# EasyEDA Pro project ProPrj_RMwork_2025-11-14.epro

# Schematic Schematic1
Board Name: Board1; Create Date: 2025-11-13; Page Name: P1; Project Name: RMwork; Schematic Name: Schematic1; Update Date: 2025-11-14; Company: 嘉立创EDA; Page Size: A4; Version: V1.0
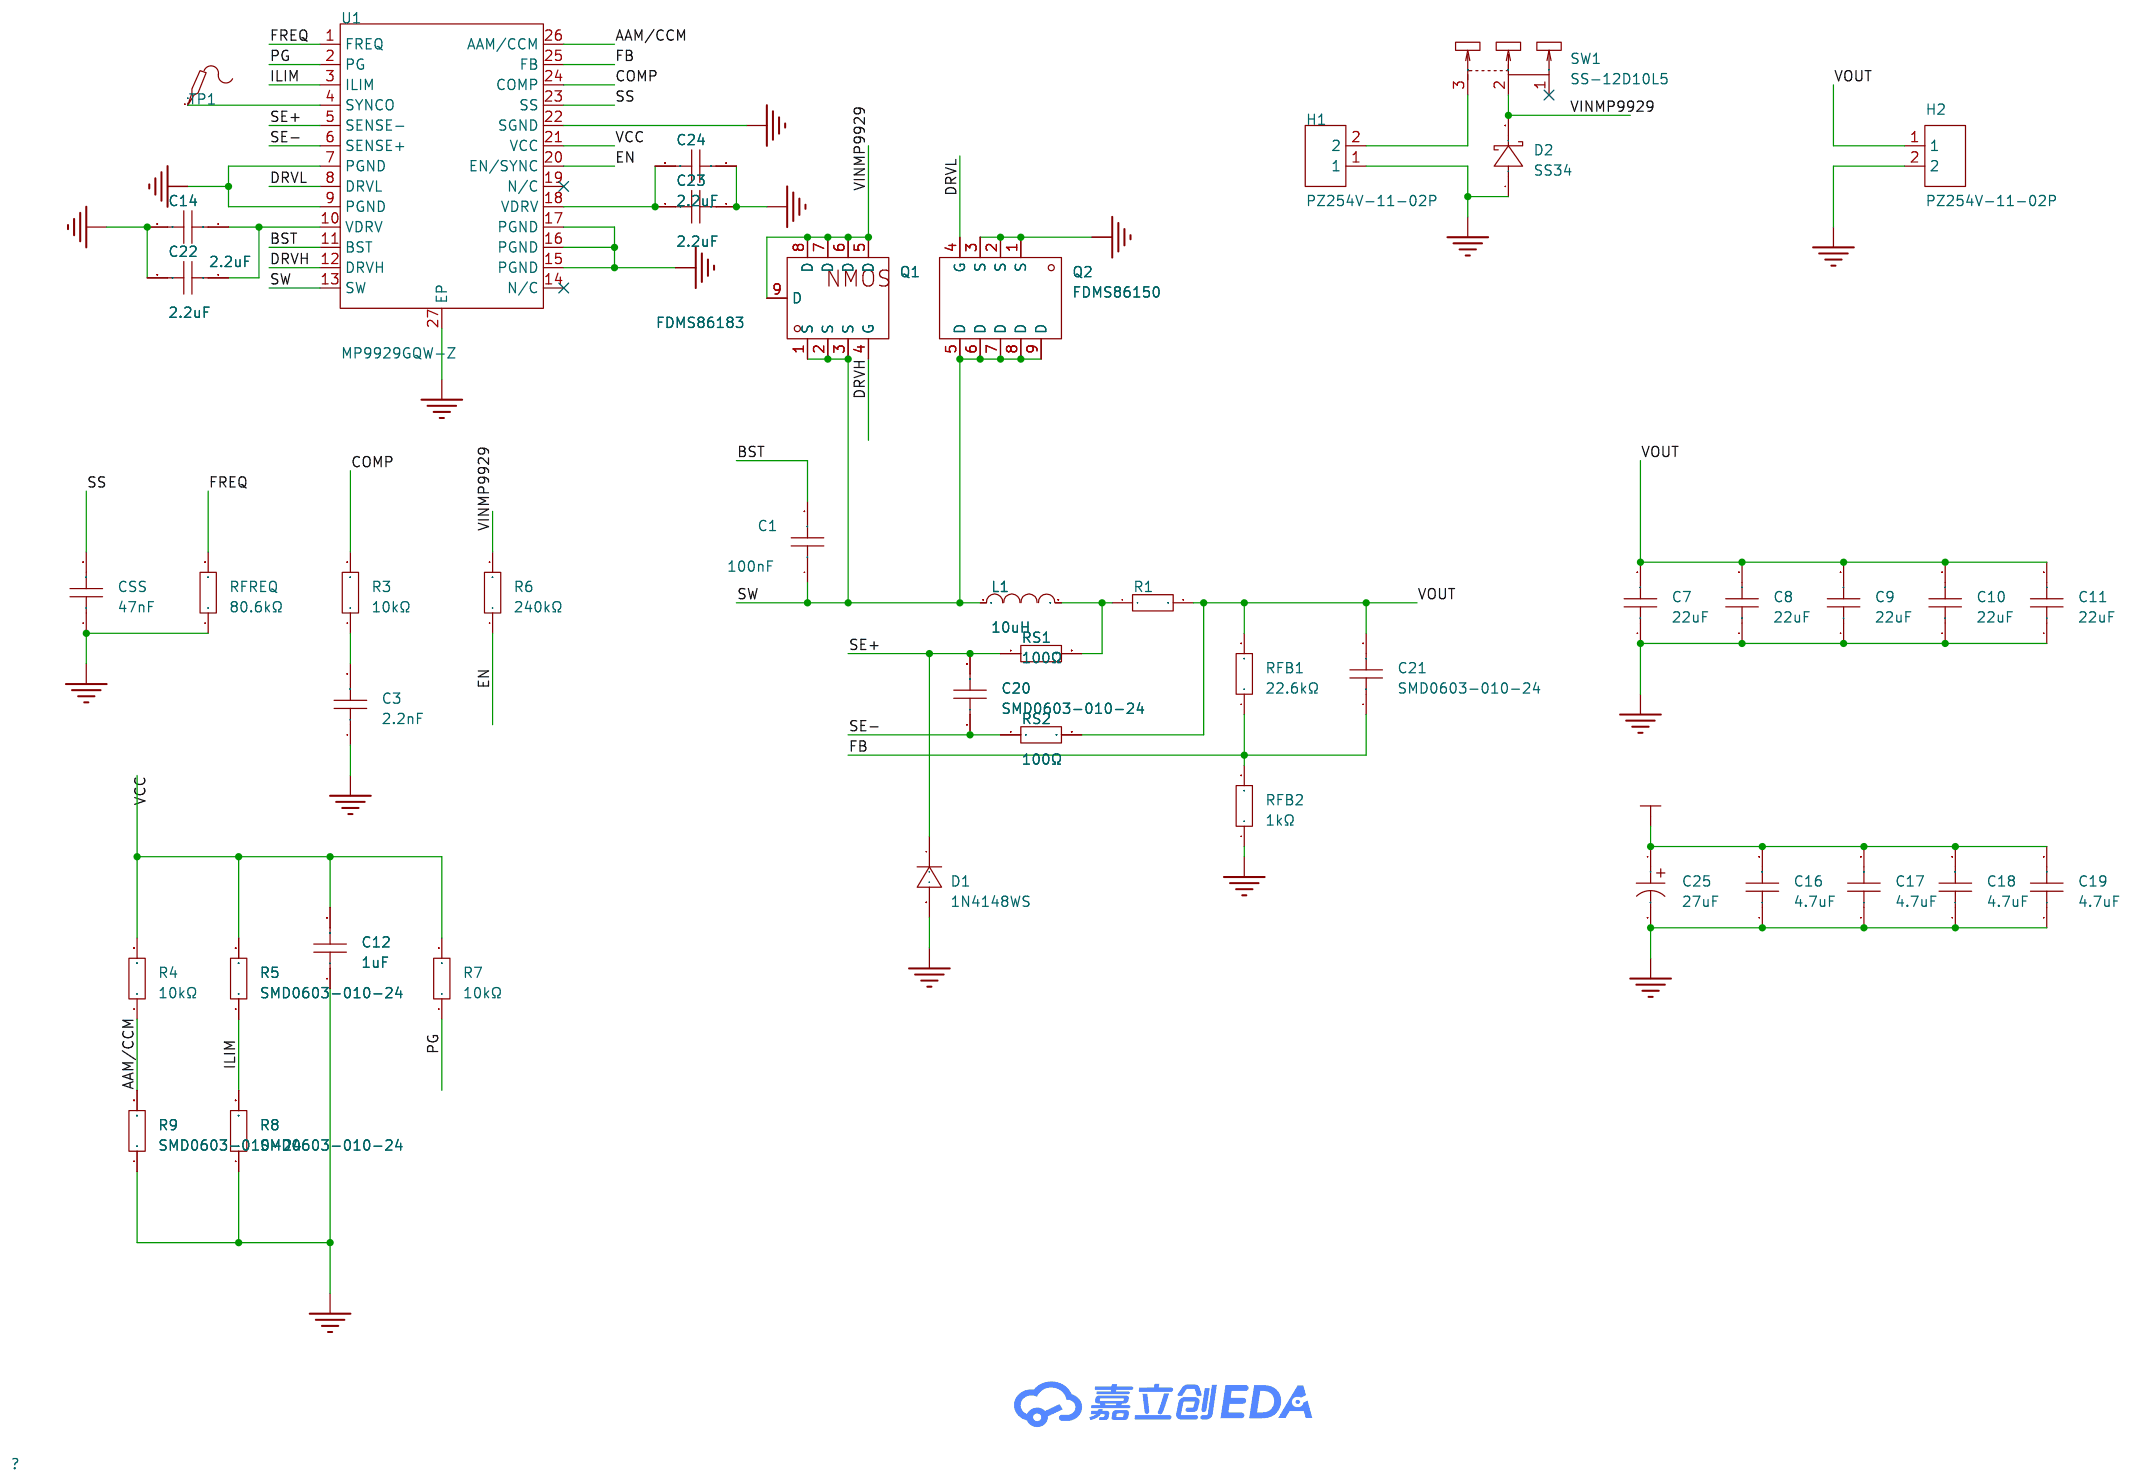
[diagram p0: schematic sheet]

## Parts
C1  100nF  [C0603]
C3  2.2nF  [C0603]
C7  22uF  [C0603]
C8  22uF  [C0603]
C9  22uF  [C0603]
C10  22uF  [C0603]
C11  22uF  [C0603]
C12  1uF  [C0603]
C14  2.2uF  [C0603]
C16  4.7uF  [C0603]
C17  4.7uF  [C0603]
C18  4.7uF  [C0603]
C19  4.7uF  [C0603]
C20  SMD0603-010-24  [F0603]
C21  SMD0603-010-24  [F0603]
C22  2.2uF  [C0603]
C23  2.2uF  [C0603]
C24  2.2uF  [C0603]
C25  27uF  [CAP-SMD_BD5.0-L5.3-W5.3-LS6.0-FD]
CSS  47nF  [C0603]
D1  1N4148WS  [SOD-323_L1.8-W1.3-LS2.5-RD]
D2  SS34  [SMA_L4.3-W2.6-LS5.0-FD]
H1  PZ254V-11-02P  [HDR-TH_2P-P2.54-V-M]
H2  PZ254V-11-02P  [HDR-TH_2P-P2.54-V-M]
L1  10uH  [IND-SMD_L11.5-W10.0_FXL1040]
Q1  FDMS86183  [POWER-56_L5.0-W6.0-P1.27-LS6.2-BL]
Q2  FDMS86150  [POWER-56_L5.0-W6.0-P1.27-LS6.2-BL]
R1  6mΩ  [RES-SMD_L6.4-W3.2-R2512]
R3  10kΩ  [R0603]
R4  10kΩ  [R0603]
R5  SMD0603-010-24  [F0603]
R6  240kΩ  [R0603]
R7  10kΩ  [R0603]
R8  SMD0603-010-24  [F0603]
R9  SMD0603-010-24  [F0603]
RFB1  22.6kΩ  [R0603]
RFB2  1kΩ  [R0603]
RFREQ  80.6kΩ  [R0603]
RS1  100Ω  [R0603]
RS2  100Ω  [R0603]
SW1  SS-12D10L5  [SW-TH_SS-12D10L5]
TP1  -  [Test-Point-0.5mm]
U1  MP9929GQW-Z  [QFN-26_L6.0-W4.0-P0.50_MP9929GQW-Z]

## Library data of the parts
C1 = CC0603KRX7R9BB104: 容值:100nF;精度:±10%;额定电压:50V;温度系数:X7R;; LCSC Part Name: 100nF ±10% 50V; Supplier Part: C14663; Manufacturer: YAGEO(国巨); Supplier Footprint: 0603; JLCPCB Part Class: Basic Part; Datasheet: https://item.szlcsc.com/datasheet/CC0603KRX7R9BB104/15331.html; Supplier: LCSC; Tolerance: ±10%; Voltage Rating: 50V; Temperature Coefficient: X7R
C3 = FCC0603B222K500CT: 容值:2.2nF;精度:±10%;额定电压:50V;温度系数:X7R;; LCSC Part Name: 2.2nF ±10% 50V; Supplier Part: C5137562; Manufacturer: FOJAN(富捷); Supplier Footprint: 0603; JLCPCB Part Class: Extended Part; Datasheet: https://atta.szlcsc.com/upload/public/pdf/source/20220818/0EB3B7FB2F5648AC16609637FBA7DABE.pdf; Supplier: LCSC; Tolerance: ±10%; Voltage Rating: 50V; Temperature Coefficient: X7R
C7-C11 = CGA0603X5R226M160JT: 容值:22uF;精度:±20%;额定电压:16V;温度系数:X5R;; LCSC Part Name: 22uF ±20% 16V; Supplier Part: C6119868; Manufacturer: HRE(芯声); Supplier Footprint: 0603; JLCPCB Part Class: Extended Part; Datasheet: https://item.szlcsc.com/datasheet/CGA0603X5R226M160JT/7062574.html; Supplier: LCSC; Tolerance: ±20%; Voltage Rating: 16V; Temperature Coefficient: X5R
C12 = CGA0603X5R105K160JT: 容值:1uF;精度:±10%;额定电压:16V;温度系数:X5R;; LCSC Part Name: 1uF ±10% 16V; Supplier Part: C6119849; Manufacturer: HRE(芯声); Supplier Footprint: 0603; JLCPCB Part Class: Extended Part; Supplier: LCSC; Tolerance: ±10%; Voltage Rating: 16V; Temperature Coefficient: X5R
C14 C22-C24 = CL10A225KA8NNNC: 容值:2.2uF;精度:±10%;额定电压:25V;温度系数:X5R;; LCSC Part Name: 2.2uF ±10% 25V; Supplier Part: C57895; Manufacturer: SAMSUNG(三星); Supplier Footprint: 0603; JLCPCB Part Class: Extended Part; Datasheet: https://item.szlcsc.com/datasheet/CL10A225KA8NNNC/58932.html; Supplier: LCSC; Tolerance: ±10%; Voltage Rating: 25V; Temperature Coefficient: X5R
C16-C19 = CL10A475KO8NNNC: 容值:4.7uF;精度:±10%;额定电压:16V;温度系数:X5R;; LCSC Part Name: 4.7uF ±10% 16V; Supplier Part: C19666; Manufacturer: SAMSUNG(三星); Supplier Footprint: 0603; JLCPCB Part Class: Basic Part; Datasheet: https://item.szlcsc.com/datasheet/CL10A475KO8NNNC/20375.html; Supplier: LCSC; Tolerance: ±10%; Voltage Rating: 16V; Temperature Coefficient: X5R
C20 C21 R5 R8 R9 = SMD0603-010-24: 耐压(Vmax):24V;最大电流(Imax):40A;保持电流(Ihold):100mA;跳闸电流(Itrip):300mA;; Supplier Part: C46640956; Manufacturer: R+O(宏嘉诚); Supplier Footprint: 0603; JLCPCB Part Class: Extended Part; Datasheet: https://item.szlcsc.com/datasheet/SMD0603-010-24/48798662.html; Supplier: LCSC; Voltage - Max: 24V; Current - Max: 40A; Hold Current: 100mA; Trip Current: 300mA; Power Dissipation: 500mW; Resistance - Initial (Ri) (Min): 900mΩ; Resistance - Post Trip (R1) (Max): 8Ω; Time to Trip(Max): 600ms; Operating Temperature: -40℃~+85℃; Length: 1.6mm; Width: 0.8mm
C25 = 25SVPF27MX: 容值:27uF;精度:±20%;额定电压:25V;纹波电流:2.45A@100kHz;等效串联电阻(ESR):-;类型:聚合物;; LCSC Part Name: 27uF ±20% 25V; Supplier Part: C347564; Manufacturer: PANASONIC(松下); Supplier Footprint: SMD,D5xL5.9mm; JLCPCB Part Class: Extended Part; Datasheet: https://item.szlcsc.com/datasheet/25SVPF27MX/324244.html; Supplier: LCSC; Tolerance: ±20%; Voltage Rating: 25V; Ripple Current: 2.45A@100kHz; Type: 聚合物; Diameter: 5mm; Height - Seated (Max): 5.9mm; Lifetime: 5000hrs@105℃; Operating Temperature: -55℃~+105℃
CSS = CL10B473KB8NNNC: 容值:47nF;精度:±10%;额定电压:50V;温度系数:X7R;; LCSC Part Name: 47nF ±10% 50V; Supplier Part: C1622; Manufacturer: SAMSUNG(三星); Supplier Footprint: 0603; JLCPCB Part Class: Basic Part; Datasheet: https://item.szlcsc.com/datasheet/CL10B473KB8NNNC/1974.html; Supplier: LCSC; Tolerance: ±10%; Voltage Rating: 50V; Temperature Coefficient: X7R
D1 = 1N4148WS_C2128: 二极管配置:独立式;正向压降(Vf):1.25V@150mA;直流反向耐压(Vr):100V;整流电流:150mA;反向恢复时间(Trr):4ns;; LCSC Part Name: 丝印T4 1N4148WS; Supplier Part: C2128; Manufacturer: CJ(江苏长电/长晶); Supplier Footprint: SOD-323; JLCPCB Part Class: 基础库; Datasheet: https://item.szlcsc.com/datasheet/1N4148WS/2485.html; Supplier: LCSC; Diode Configuration: 独立式; Voltage - Forward(Vf@If): 1.25V@150mA; Voltage - DC Reverse(Vr): 100V; Current - Rectified: 150mA; Pd - Power Dissipation: 200mW; Reverse Leakage Current (Ir): 1uA@75V; Reverse Recovery Time (trr): 4ns; Non-Repetitive Peak Forward Surge Current: 2A
D2 = SS34_C7420365: 二极管配置:独立式;正向压降(Vf):550mV@3.0A;直流反向耐压(Vr):40V;整流电流:3A;; LCSC Part Name: 电压:40V 电流:3A; Supplier Part: C7420365; Manufacturer: R+O(宏嘉诚); Supplier Footprint: SMA(DO-214AC); JLCPCB Part Class: 扩展库; Datasheet: https://item.szlcsc.com/datasheet/SS34/8397187.html; Supplier: LCSC; Diode Configuration: 独立式; Voltage - Forward(Vf@If): 550mV@3.0A; Voltage - DC Reverse(Vr): 40V; Current - Rectified: 3A; Reverse Leakage Current (Ir): 200uA@40V
H1 H2 = PZ254V-11-02P: 插针结构:1x2P;间距:2.54mm;行距:-;圆针/方针:方针;安装方式:直插;排数:单排;总PIN位数:2P;额定电流:-;额定电压:-;配合针长度:6mm;塑高:2.5mm;端接针长度:3mm;触头材质:黄铜;触头镀层:-;工作温度:-40℃~+105℃;颜色:黑色;; LCSC Part Name: 1x2P 间距:2.54mm 方针 直插; Supplier Part: C492401; Manufacturer: XFCN(兴飞); Supplier Footprint: 插件,P=2.54mm; JLCPCB Part Class: 扩展库; Datasheet: https://item.szlcsc.com/datasheet/PZ254V-11-02P/502957.html; Supplier: LCSC; Pin Structure: 1x2P; Pitch: 2.54mm; Circluar Pins/Square Pins: 方针; Mounting Type: 直插; Number of Rows: 单排; Number of Pins: 2P; Length of Mating Pin: 6mm; Insulation Height: 2.5mm; Length of End Connection Pin: 3mm; Contact Material: 黄铜; Operating Temperature: -40℃~+105℃; Color: 黑色
L1 = FXL1040-100-M: 电感值:10uH;精度:±20%;额定电流:7.8A;饱和电流(Isat):8.5A;类型:一体成型电感;; LCSC Part Name: 10uH ±20% 8.5A; Supplier Part: C475915; Manufacturer: cjiang(长江微电); Supplier Footprint: SMD,11.5x10mm; JLCPCB Part Class: Extended Part; Datasheet: https://atta.szlcsc.com/upload/public/pdf/source/20240426/3189EA8206330E2108542F9E34E540E7.pdf; Supplier: LCSC; Tolerance: ±20%; Rated Current: 7.8A; Current - Saturation (Isat): 8.5A; DC Resistance (DCR): 30mΩ; Type: 一体成型电感
Q1 = FDMS86183: 类型:-;漏源电压(Vdss):-;连续漏极电流(Id):-;功率(Pd):-;导通电阻(RDS(on)@Vgs,Id):-;阈值电压(Vgs(th)@Id):-;; LCSC Part Name: N 沟道屏蔽门极 PowerTrench MOSFET 100 V，51 A，12.8 mΩ; Supplier Part: C891093; Manufacturer: onsemi(安森美); Supplier Footprint: Power-56-8; JLCPCB Part Class: 扩展库; Datasheet: https://atta.szlcsc.com/upload/public/pdf/source/20210624/C891093_BCD16E45048C0D0D4E3284DC0FFDD818.pdf; Supplier: LCSC
Q2 = FDMS86150: 数量:1个N沟道;漏源电压(Vdss):100V;连续漏极电流(Id):80A;导通电阻(RDS(on)):7.8mΩ@6V,13A;耗散功率(Pd):156W;阈值电压(Vgs(th)):2V;; LCSC Part Name: 1个N沟道 耐压:100V 电流:80A; Supplier Part: C455161; Manufacturer: onsemi(安森美); Supplier Footprint: Power56-8; JLCPCB Part Class: 扩展库; Datasheet: https://item.szlcsc.com/datasheet/FDMS86150/457746.html; Supplier: LCSC; Number: 1个N沟道; Drain to Source Voltage: 100V; Current - Continuous Drain(Id): 80A; RDS(on): 7.8mΩ@6V,13A; Pd - Power Dissipation: 156W; Gate Threshold Voltage (Vgs(th)): 2V; Input Capacitance(Ciss): 3.055nF@50V; Reverse Transfer Capacitance (Crss@Vds): 29pF@50V; Operating Temperature: -55℃~+150℃
R1 = RE2512F3R006: 电阻类型:采样电阻；合金电阻;阻值:6mΩ;精度:±1%;功率:3W;温度系数:±100ppm/℃;; LCSC Part Name: 6mΩ 3W 2512 ±1%; Supplier Part: C46961751; Manufacturer: JIERR(捷而瑞); Supplier Footprint: 2512; JLCPCB Part Class: Extended Part; Datasheet: https://item.szlcsc.com/datasheet/RE2512F3R006/49133290.html; Supplier: LCSC; Type: 采样电阻；合金电阻; Tolerance: ±1%; Power(Watts): 3W; Temperature Coefficient: ±100ppm/℃
R3 R4 R7 = 0603WAF1002T5E: 电阻类型:厚膜电阻;阻值:10kΩ;精度:±1%;功率:100mW;工作电压:75V;温度系数:±100ppm/℃;; LCSC Part Name: 厚膜电阻 10kΩ ±1% 100mW; Supplier Part: C25804; Manufacturer: UNI-ROYAL(厚声); Supplier Footprint: 0603; JLCPCB Part Class: Basic Part; Datasheet: https://item.szlcsc.com/datasheet/0603WAF1002T5E/26547.html; Supplier: LCSC; Type: 厚膜电阻; Tolerance: ±1%; Power(Watts): 100mW; Voltage-Supply(Max): 75V; Temperature Coefficient: ±100ppm/℃; Operating Temperature: -55℃~+155℃
R6 = 0603WAF2403T5E: 电阻类型:厚膜电阻;阻值:240kΩ;精度:±1%;功率:100mW;最大工作电压:75V;温度系数:±100ppm/℃;; LCSC Part Name: 240kΩ ±1% 100mW 厚膜电阻; Supplier Part: C4197; Manufacturer: UNI-ROYAL(厚声); Supplier Footprint: 0603; JLCPCB Part Class: Extended Part; Datasheet: https://atta.szlcsc.com/upload/public/pdf/source/20200306/C422600_1E6D84923E4A46A82E41ADD87F860B5C.pdf; Supplier: LCSC; Type: 厚膜电阻; Tolerance: ±1%; Power(Watts): 100mW; Overload Voltage (Max): 75V; Temperature Coefficient: ±100ppm/℃; Operating Temperature Range: -55℃~+155℃
RFB1 = PTFR0603B22K6N9: 电阻类型:薄膜电阻;阻值:22.6kΩ;精度:±0.1%;功率:100mW;工作电压:100V;温度系数:±10ppm/℃;; LCSC Part Name: 薄膜电阻 22.6kΩ ±0.1% 100mW; Supplier Part: C5382615; Manufacturer: RESI(开步睿思); Supplier Footprint: 0603; JLCPCB Part Class: Extended Part; Datasheet: https://item.szlcsc.com/datasheet/PTFR0603B22K6N9/6255150.html; Supplier: LCSC; Type: 薄膜电阻; Tolerance: ±0.1%; Power(Watts): 100mW; Voltage-Supply(Max): 100V; Temperature Coefficient: ±10ppm/℃; Operating Temperature: -55℃~+155℃
RFB2 = FRC0603F1001TS: 电阻类型:厚膜电阻;阻值:1kΩ;精度:±1%;功率:100mW;工作电压:75V;温度系数:±100ppm/℃;; LCSC Part Name: 1kΩ ±1% 100mW 厚膜电阻; Supplier Part: C2907002; Manufacturer: FOJAN(富捷); Supplier Footprint: 0603; JLCPCB Part Class: Extended Part; Supplier: LCSC; Type: 厚膜电阻; Tolerance: ±1%; Power(Watts): 100mW; Voltage-Supply(Max): 75V; Temperature Coefficient: ±100ppm/℃; Operating Temperature: -55℃~+155℃
RFREQ = FRC0603F8062TS: 电阻类型:厚膜电阻;阻值:80.6kΩ;精度:±1%;功率:100mW;工作电压:75V;温度系数:±100ppm/℃;; LCSC Part Name: 80.6kΩ ±1% 100mW 厚膜电阻; Supplier Part: C2933260; Manufacturer: FOJAN(富捷); Supplier Footprint: 0603; JLCPCB Part Class: Extended Part; Supplier: LCSC; Type: 厚膜电阻; Tolerance: ±1%; Power(Watts): 100mW; Voltage-Supply(Max): 75V; Temperature Coefficient: ±100ppm/℃; Operating Temperature: -55℃~+155℃
RS1 RS2 = 0603WAF1000T5E: 电阻类型:厚膜电阻;阻值:100Ω;精度:±1%;功率:100mW;最大工作电压:75V;温度系数:±200ppm/℃;; LCSC Part Name: 100Ω ±1% 100mW 厚膜电阻; Supplier Part: C22775; Manufacturer: UNI-ROYAL(厚声); Supplier Footprint: 0603; JLCPCB Part Class: Basic Part; Datasheet: https://atta.szlcsc.com/upload/public/pdf/source/20200306/C422600_1E6D84923E4A46A82E41ADD87F860B5C.pdf; Supplier: LCSC; Type: 厚膜电阻; Tolerance: ±1%; Power(Watts): 100mW; Overload Voltage (Max): 75V; Temperature Coefficient: ±200ppm/℃; Operating Temperature Range: -55℃~+155℃
SW1 = SS-12D10L5: 电路结构:单刀双掷;安装方式:直插;开关颜色:黑色;额定电流:3A;额定电压:125V;工作寿命:1万次;; LCSC Part Name: 柄长5mm 直插双档 滑动开关; Supplier Part: C319012; Manufacturer: XKB Connection(中国星坤); Supplier Footprint: 插件,13x6.8mm; JLCPCB Part Class: 扩展库; Datasheet: https://item.szlcsc.com/datasheet/SS-12D10L5/300104.html; Supplier: LCSC; Circuit: 单刀双掷; Actuator Style: 矩形柱状; Termination Style: PC引脚; Length: 13mm; Width: 6.8mm; Switch Height: 6.4mm; Mounting Type: 直插; Actuator Color: 黑色; Current Rating: 3A; Voltage Rating: 125V; Life: 1万次; Operating Temperature: -40℃~+85℃
TP1 = Test-Point: Test Point 测试点
U1 = MP9929GQW-Z: Supplier Part: C16197344; Manufacturer: MPS(芯源); Supplier Footprint: QFN-26-EP(4x6); JLCPCB Part Class: 扩展库; Supplier: LCSC

## Nets
GND: C3.1 C7.1 C8.1 C9.1 C10.1 C11.1 C12.1 C14.2 C16.1 C17.1 C18.1 C19.1 C22.2 C23.1 C24.1 C25.2 CSS.1 D1.2(A) D2.1(A) H1.1 H2.2 Q2.1(S) Q2.2(S) Q2.3(S) R8.1 R9.1 RFB2.1 RFREQ.1 U1.7(PGND) U1.9(PGND) U1.15(PGND) U1.16(PGND) U1.17(PGND) U1.22(SGND) U1.27(EP)
VCC: C12.2 R4.2 R5.2 R7.2 U1.21(VCC)
VINMP9929: C16.2 C17.2 C18.2 C19.2 C25.1 D2.2(K) Q1.5(D) Q1.6(D) Q1.7(D) Q1.8(D) Q1.9(D) R6.2 SW1.2
AAM/CCM: R4.1 R9.2 U1.26(AAM/CCM)
BST: C1.2 U1.11(BST)
COMP: R3.2 U1.24(COMP)
DRVH: Q1.4(G) U1.12(DRVH)
DRVL: Q2.4(G) U1.8(DRVL)
EN: R6.1 U1.20(EN/SYNC)
FB: C21.1 RFB1.1 RFB2.2 U1.25(FB)
FREQ: RFREQ.2 U1.1(FREQ)
ILIM: R5.1 R8.2 U1.3(ILIM)
PG: R7.1 U1.2(PG)
SE+: C20.2 D1.1(K) RS1.1 U1.5(SENSE-)
SE-: C20.1 RS2.1 U1.6(SENSE+)
SS: CSS.2 U1.23(SS)
SW: C1.1 L1.1 Q1.1(S) Q1.2(S) Q1.3(S) Q2.5(D) Q2.6(D) Q2.7(D) Q2.8(D) Q2.9(D) U1.13(SW)
VOUT: C7.2 C8.2 C9.2 C10.2 C11.2 C21.2 H2.1 R1.2 RFB1.2 RS2.2
$1N1291: L1.2 R1.1 RS1.2
$1N2376: C3.2 R3.1
$1N3160: TP1.1 U1.4(SYNCO)
$1N3351: C23.2 C24.2 U1.18(VDRV)
$1N3457: C14.1 C22.1 U1.10(VDRV)
$1N5328: H1.2 SW1.3

Not connected (* = marked no-connect by the designer): SW1 1*; U1 14(N/C)* 19(N/C)*

# Board PCB1
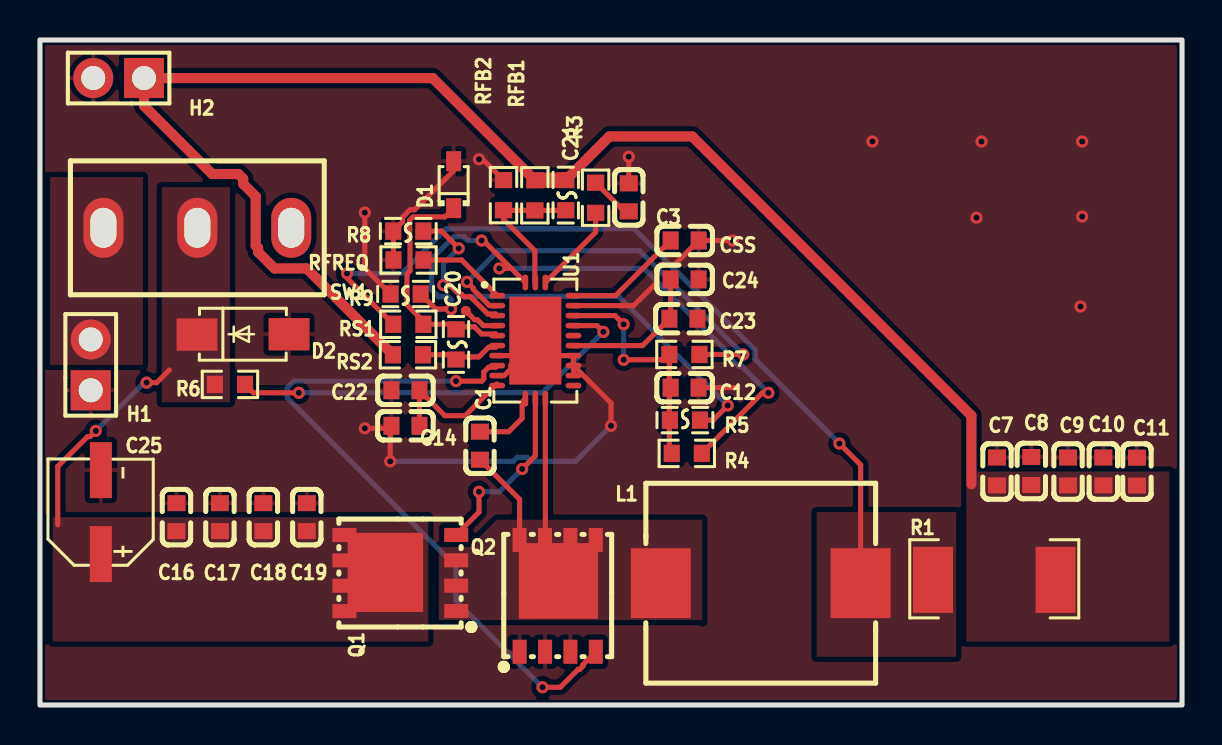
[diagram p1: board, top side]
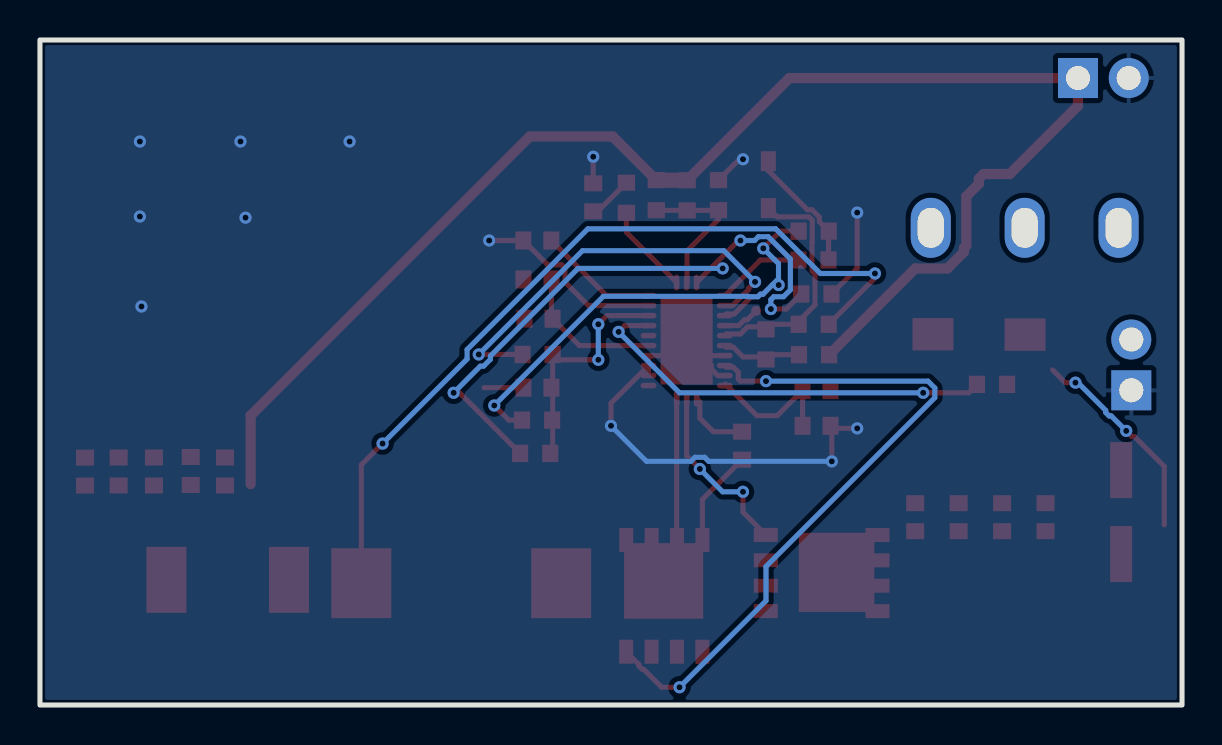
[diagram p2: board, bottom side, seen from below]

Outline 57.15 x 33.27 mm; copper layers: Top Layer, Bottom Layer. Coordinates in mm from the lower left corner of the outline.
Outline path: rectangle 0,33.27 57.15,0
Stack: Top Layer 0.035mm / Dielectric1 1.51mm FR4 er 4.5 / Bottom Layer 0.035mm

## Design rules (mm)
template: 自定义配置
spacing copperThickness1oz (default): track to track 0.102, other pairs 0.152 to 0.508
spacing copperThickness2oz: track to track 0.203, other pairs 0.152 to 0.3
track width copperThickness1oz (default): min 0.127, default 0.254, max 2.54
track width copperThickness2oz: min 0.203, default 0.254, max 2.54
differential pair differentialPair (default): width min 0.127, default 0.254, max 2.54; gap min 0.152, default 0.152
via viaSize (default): diameter min 0.5, default 0.61, max 10; hole min 0.3, default 0.305, max 6.299

## Placement (name value [footprint] x y rotation side)
C1  100nF  [C0603]  22.02 12.97 90 top
C3  2.2nF  [C0603]  29.46 25.4 270 top
C7  22uF  [C0603]  47.89 11.68 270 top
C8  22uF  [C0603]  49.61 11.71 270 top
C9  22uF  [C0603]  51.45 11.68 270 top
C10  22uF  [C0603]  53.21 11.68 270 top
C11  22uF  [C0603]  54.89 11.68 270 top
C12  1uF  [C0603]  32.26 15.88 180 top
C14  2.2uF  [C0603]  18.29 13.97 180 top
C16  4.7uF  [C0603]  6.83 9.4 270 top
C17  4.7uF  [C0603]  9.01 9.4 270 top
C18  4.7uF  [C0603]  11.18 9.4 270 top
C19  4.7uF  [C0603]  13.35 9.4 270 top
C20  SMD0603-010-24  [F0603]  20.82 18.04 90 top
C21  SMD0603-010-24  [F0603]  26.31 25.51 90 top
C22  2.2uF  [C0603]  18.29 15.75 180 top
C23  2.2uF  [C0603]  32.2 19.33 180 top
C24  2.2uF  [C0603]  32.26 21.3 180 top
C25  27uF  [CAP-SMD_BD5.0-L5.3-W5.3-LS6.0-FD]  3.05 9.65 90 top
CSS  47nF  [C0603]  32.26 23.24 180 top
D1  1N4148WS  [SOD-323_L1.8-W1.3-LS2.5-RD]  20.7 26.03 90 top
D2  SS34  [SMA_L4.3-W2.6-LS5.0-FD]  10.16 18.54 180 top
H1  PZ254V-11-02P  [HDR-TH_2P-P2.54-V-M]  2.54 17.02 90 top
H2  PZ254V-11-02P  [HDR-TH_2P-P2.54-V-M]  3.94 31.37 180 top
L1  10uH  [IND-SMD_L11.5-W10.0_FXL1040]  36.07 6.1 0 top
Q1  FDMS86183  [POWER-56_L5.0-W6.0-P1.27-LS6.2-BL]  18.03 6.6 90 top
Q2  FDMS86150  [POWER-56_L5.0-W6.0-P1.27-LS6.2-BL]  25.91 5.46 0 top
R1  6mΩ  [RES-SMD_L6.4-W3.2-R2512]  47.75 6.26 0 top
R3  10kΩ  [R0603]  27.8 25.38 270 top
R4  10kΩ  [R0603]  32.37 12.59 180 top
R5  SMD0603-010-24  [F0603]  32.27 14.25 180 top
R6  240kΩ  [R0603]  9.51 16.04 180 top
R7  10kΩ  [R0603]  32.25 17.54 180 top
R8  SMD0603-010-24  [F0603]  18.43 23.71 0 top
R9  SMD0603-010-24  [F0603]  18.3 20.57 0 top
RFB1  22.6kΩ  [R0603]  24.76 25.5 90 top
RFB2  1kΩ  [R0603]  23.2 25.51 270 top
RFREQ  80.6kΩ  [R0603]  18.44 22.26 0 top
RS1  100Ω  [R0603]  18.43 19.05 180 top
RS2  100Ω  [R0603]  18.42 17.53 180 top
SW1  SS-12D10L5  [SW-TH_SS-12D10L5]  7.87 23.88 180 top
TP1  -  [Test-Point-0.5mm]  21.31 19.72 0 top
U1  MP9929GQW-Z  [QFN-26_L6.0-W4.0-P0.50_MP9929GQW-Z]  24.79 18.23 270 top

## Footprints (pads in the part's own frame, mm; a bottom-side part is the same pattern mirrored in y, then rotated)
C0603
  rect 0.8x0.9 smd: 1(-0.7,0) 2(0.7,0)
CAP-SMD_BD5.0-L5.3-W5.3-LS6.0-FD
  rect 2.8x1.1 smd: 1(-2.1,0) 2(2.1,0)
F0603
  rect 0.806x0.864 smd: 1(-0.753,0) 2(0.753,0)
HDR-TH_2P-P2.54-V-M
  rect 2x2 hole 1.2: 1(-1.27,0)
  round 2 hole 1.2: 2(1.27,0)
IND-SMD_L11.5-W10.0_FXL1040
  rect 3x3.5 smd: 1(-5,0) 2(5,0)
POWER-56_L5.0-W6.0-P1.27-LS6.2-BL
  rect 0.7x1.2 smd: 1(-1.903,-2.796) 2(-0.633,-2.796) 3(0.636,-2.796) 4(1.907,-2.796) 5(1.903,2.796) 6(0.633,2.796) 7(-0.636,2.796) 8(-1.907,2.796)
  rect 3.96x3.78 smd: 9(0.032,0.748)
QFN-26_L6.0-W4.0-P0.50_MP9929GQW-Z
  oval 0.28x0.79 smd: 1(-2.25,-1.907) 2(-1.75,-1.907) 3(-1.25,-1.907) 4(-0.75,-1.907) 5(-0.25,-1.907) 6(0.25,-1.907) 7(0.75,-1.907) 8(1.25,-1.907) 9(1.75,-1.907) 10(2.25,-1.907) 14(2.25,1.907) 15(1.75,1.907) 16(1.25,1.907) 17(0.75,1.907) 18(0.25,1.907) 19(-0.25,1.907) 20(-0.75,1.907) 21(-1.25,1.907) 22(-1.75,1.907) 23(-2.25,1.907)
  oval 0.79x0.28 smd: 11(2.908,-0.5) 12(2.908,0) 13(2.908,0.5) 24(-2.908,0.5) 25(-2.908,0) 26(-2.908,-0.5)
  rect 4.4x2.6 smd: 27(0,0)
R0603
  rect 0.806x0.864 smd: 1(-0.753,0) 2(0.753,0)
RES-SMD_L6.4-W3.2-R2512
  rect 2x3.3 smd: 1(-3.067,0) 2(3.067,0)
SMA_L4.3-W2.6-LS5.0-FD
  rect 2.046x1.62 smd: 1(-2.304,-0.009) 2(2.304,0.009)
SOD-323_L1.8-W1.3-LS2.5-RD
  rect 1x0.75 smd: 1(-1.173,0) 2(1.173,0)
SW-TH_SS-12D10L5
  oval 2x3 hole 1.3x2: 1(-4.7,0) 2(0,0) 3(4.7,0)
Test-Point-0.5mm
  round 0.5 smd: 1(0,0)

## Nets
As in the schematic.

Pads without a net: SW1 1; U1 14 19

## Via types
v1: diameter 0.61, hole 0.305, Top Layer to Bottom Layer, 34 vias

## Routing (per net, layer and track width the routed paths; a pad name or vN(x,y) marks a point on that pad's centre or on a via; arc(x,y) is an arc through that point)
GND: length 50.4
  Top Layer w0.254: v1(17.53,12.19) 17.53,13.91 17.46,13.84 v1(16.26,13.84) ; U1.7 24.04,17.48 23.56,17 23.56,16.81 23.23,16.48 U1.9 ; RFREQ.1 17.69,23.7 R8.1 18.15,24.18 18.15,24.41 18.52,24.78 18.75,24.78 20.7,26.73 D1.2 ; v1(34.67,23.24) CSS.1 31.74,22.02 31.04,22.02 30.88,21.86 30.88,21.16 29.7,19.98 U1.22 ; v1(28.58,13.97) 28.58,15.11 U1.16 ; v1(21.97,27.3) 22.16,27.3 RFB2.1 ; C3.1 v1(29.46,27.43) ; v1(16.26,24.64) 16.26,21.85 R9.1 ; U1.16 U1.15 ; U1.16 U1.17 25.54,17.48 U1.27 ; C12.1 34.92,15.88
  Bottom Layer w0.254: v1(28.58,13.97) 26.8,12.19 24.58,12.19 24.37,12.39 23.89,12.39 23.69,12.19 v1(17.53,12.19)
  vias: v1(41.66,28.19) v1(46.86,24.38) v1(47.12,28.19) v1(52.07,19.94) v1(52.15,28.19) v1(52.15,24.44)
VCC: length 11.9
  Top Layer w0.254: 31.61,12.59 31.49,12.71 R7.2 31.23,17.27 v1(29.21,17.27) ; v1(29.21,19.05) 28.78,19.48 U1.21
  Bottom Layer w0.254: v1(29.21,19.05) v1(29.21,17.27)
VINMP9929: length 10.6
  Top Layer w0.254: 0.89,9.02 0.89,11.94 2.38,13.43 2.51,13.43 v1(2.79,13.72) ; 6.48,16.76 5.84,16.13 v1(5.33,16.13)
  Bottom Layer w0.254: v1(2.79,13.72) 3.55,14.47 3.66,14.47 3.82,14.63 3.82,14.74 5.21,16.13 v1(5.33,16.13)
AAM/CCM: length 32.4
  Top Layer w0.254: R9.2 19.8,19.81 v1(20.57,19.81) ; 23.59,21.84 22.19,23.24 v1(22.1,23.24) ; 23.59,21.84 U1.26 ; 23.59,21.84 v1(22.99,21.84) ; v1(36.45,15.62) 36.15,15.62 R4.1
  Bottom Layer w0.254: v1(36.45,15.62) 35.11,16.96 34.95,16.96 34.61,17.3 34.61,17.46 30.23,21.84 v1(22.99,21.84) ; v1(20.57,19.81) 20.57,20.28 20.43,20.43 19.94,20.43 19.6,20.77 19.6,22.32 20.71,23.43 21.2,23.43 21.39,23.24 v1(22.1,23.24)
BST: length 3.4
  Top Layer w0.254: U1.11 24.13,15.17 24.13,14.35 23.45,13.67 C1.2
COMP: length 4.5
  Top Layer w0.254: R3.2 27.8,23.66 U1.24
DRVH: length 9.1
  Top Layer w0.254: Q1.4 21.97,9.65 v1(21.97,10.67) ; v1(24.13,11.81) 24.79,12.47 U1.12
  Bottom Layer w0.254: v1(21.97,10.67) 22.99,10.67 v1(24.13,11.81)
DRVL: length 34.9
  Top Layer w0.254: v1(25.15,0.89) 26.04,0.89 26.94,1.79 27.01,1.79 27.17,1.95 27.17,2.02 Q2.4 ; U1.8 22.8,16.9 22.45,16.9 22.21,16.66 22.21,16.31 22.1,16.2 v1(20.82,16.2)
  Bottom Layer w0.254: v1(25.15,0.89) 20.82,5.22 20.82,6.93 12.37,15.38 12.37,15.86 12.71,16.2 v1(20.82,16.2)
EN: length 21
  Top Layer w0.254: U1.20 27.88,18.98 v1(28.19,18.67) ; R6.1 10.68,15.62 v1(12.95,15.62)
  Bottom Layer w0.254: v1(28.19,18.67) 25.15,15.62 v1(12.95,15.62)
FB: length 7.4
  Top Layer w0.254: U1.25 24.77,21.17 24.77,22.73 23.2,24.3 RFB2.2 23.21,24.75 RFB1.1 26.3,24.75 C21.1
FREQ: length 4.4
  Top Layer w0.254: U1.1 21.1,22.26 RFREQ.2
ILIM: length 26.2
  Top Layer w0.254: U1.3 22.8,19.56 22.41,19.56 21.54,20.43 21.22,20.43 21.09,20.56 20.97,20.56 20.51,21.01 v1(20.18,21.01) ; v1(20.95,22.85) 20.09,23.71 R8.2 ; v1(34.42,14.99) 33.69,14.25 R5.1
  Bottom Layer w0.254: v1(20.95,22.85) 20.19,22.09 20.19,21.33 20.51,21.01 ; 20.51,21.01 20.97,20.56 21.09,20.56 21.22,20.43 21.7,20.43 21.72,20.45 28.96,20.45 v1(34.42,14.99) ; 20.51,21.01 v1(20.18,21.01)
PG: length 20.9
  Top Layer w0.254: v1(21.37,21.17) 21.69,20.85 21.69,20.78 22.49,19.98 U1.2 ; R7.1 v1(35.19,17.54)
  Bottom Layer w0.254: v1(21.37,21.17) 22.93,22.73 30,22.73 v1(35.19,17.54)
SE+: length 12
  Top Layer w0.254: U1.5 22.8,18.56 22.1,18.56 21.74,18.92 20.82,18.92 20.69,19.05 19.19,19.05 19.19,19.2 18.37,20.02 18.37,21.57 18.51,21.72 18.51,23.15 18.5,23.16 18.5,24.26 18.67,24.42 20.26,24.42 D1.1
SE-: length 4
  Top Layer w0.254: U1.6 22.8,17.9 22.45,17.9 21.97,17.42 20.82,17.42 20.71,17.53 RS2.1
SS: length 6
  Top Layer w0.254: U1.23 28.8,20.48 CSS.2
SW: length 11.9
  Top Layer w0.254: U1.13 25.29,8.27 Q2.7 ; C1.1 24,10.29 Q2.8
VOUT: length 74.4
  Top Layer w0.508: C21.2 28.49,28.45 32.64,28.45 46.61,14.48 46.61,11.05 ; RS2.2 13.35,21.84 11.74,21.84 10.91,22.67 10.91,22.87 10.8,22.99 10.8,25.45 10.17,26.08 10.17,26.33 9.93,26.57 8.62,26.57 5.21,29.98 H2.1 19.65,31.37 24.76,26.25
  Top Layer w0.762: C21.2 26.3,26.25 24.76,26.25
$1N1291: length 41.2
  Top Layer w0.254: v1(15.37,21.59) 15.37,21.36 RS1.2 ; L1.2 41.07,12.02 v1(40.01,13.08)
  Bottom Layer w0.254: v1(40.01,13.08) 35.78,17.31 35.78,17.78 29.73,23.83 20.33,23.83 18.1,21.59 v1(15.37,21.59)
$1N2376: length 2.3
  Top Layer w0.254: 29.46,24.7 29.24,24.7 R3.1
$1N3160: length 1.9
  Top Layer w0.254: U1.4 22.18,18.98 21.89,19.28 21.75,19.28 TP1.1
$1N3351: length 7.4
  Top Layer w0.254: U1.18 30.15,17.98 C23.2 31.56,19.39 C24.2
$1N3457: length 6.8
  Top Layer w0.254: 22.86,16.06 21.27,14.48 20.26,14.48 18.99,15.75 18.99,13.97

## Copper pours and planes (outline as drawn; the poured copper is in the pictures)
GND on Top Layer: -19.56,44.58 61.21,44.58 61.21,-4.06 -19.56,-4.06
GND on Bottom Layer: -7.24,36.7 68.71,36.7 68.71,-9.52 -7.24,-9.52
VINMP9929 on Top Layer: 0.64,9.4 19.43,9.4 19.43,3.17 0.64,3.17
VINMP9929 on Top Layer: 6.1,25.91 9.51,25.91 9.51,15.15 6.1,15.15
SW on Top Layer: 19.96,9.27 33.15,9.27 33.15,4.19 19.96,4.19
VOUT on Top Layer: 46.36,11.68 56.52,11.68 56.52,3.17 46.36,3.17
$1N1291 on Top Layer: 38.86,9.65 45.85,9.65 45.85,2.41 38.86,2.41
$1N5328 on Top Layer: 0.51,26.42 5.16,26.42 5.16,17.02 0.51,17.02
